# Altium project PCB_Project.PrjPcb
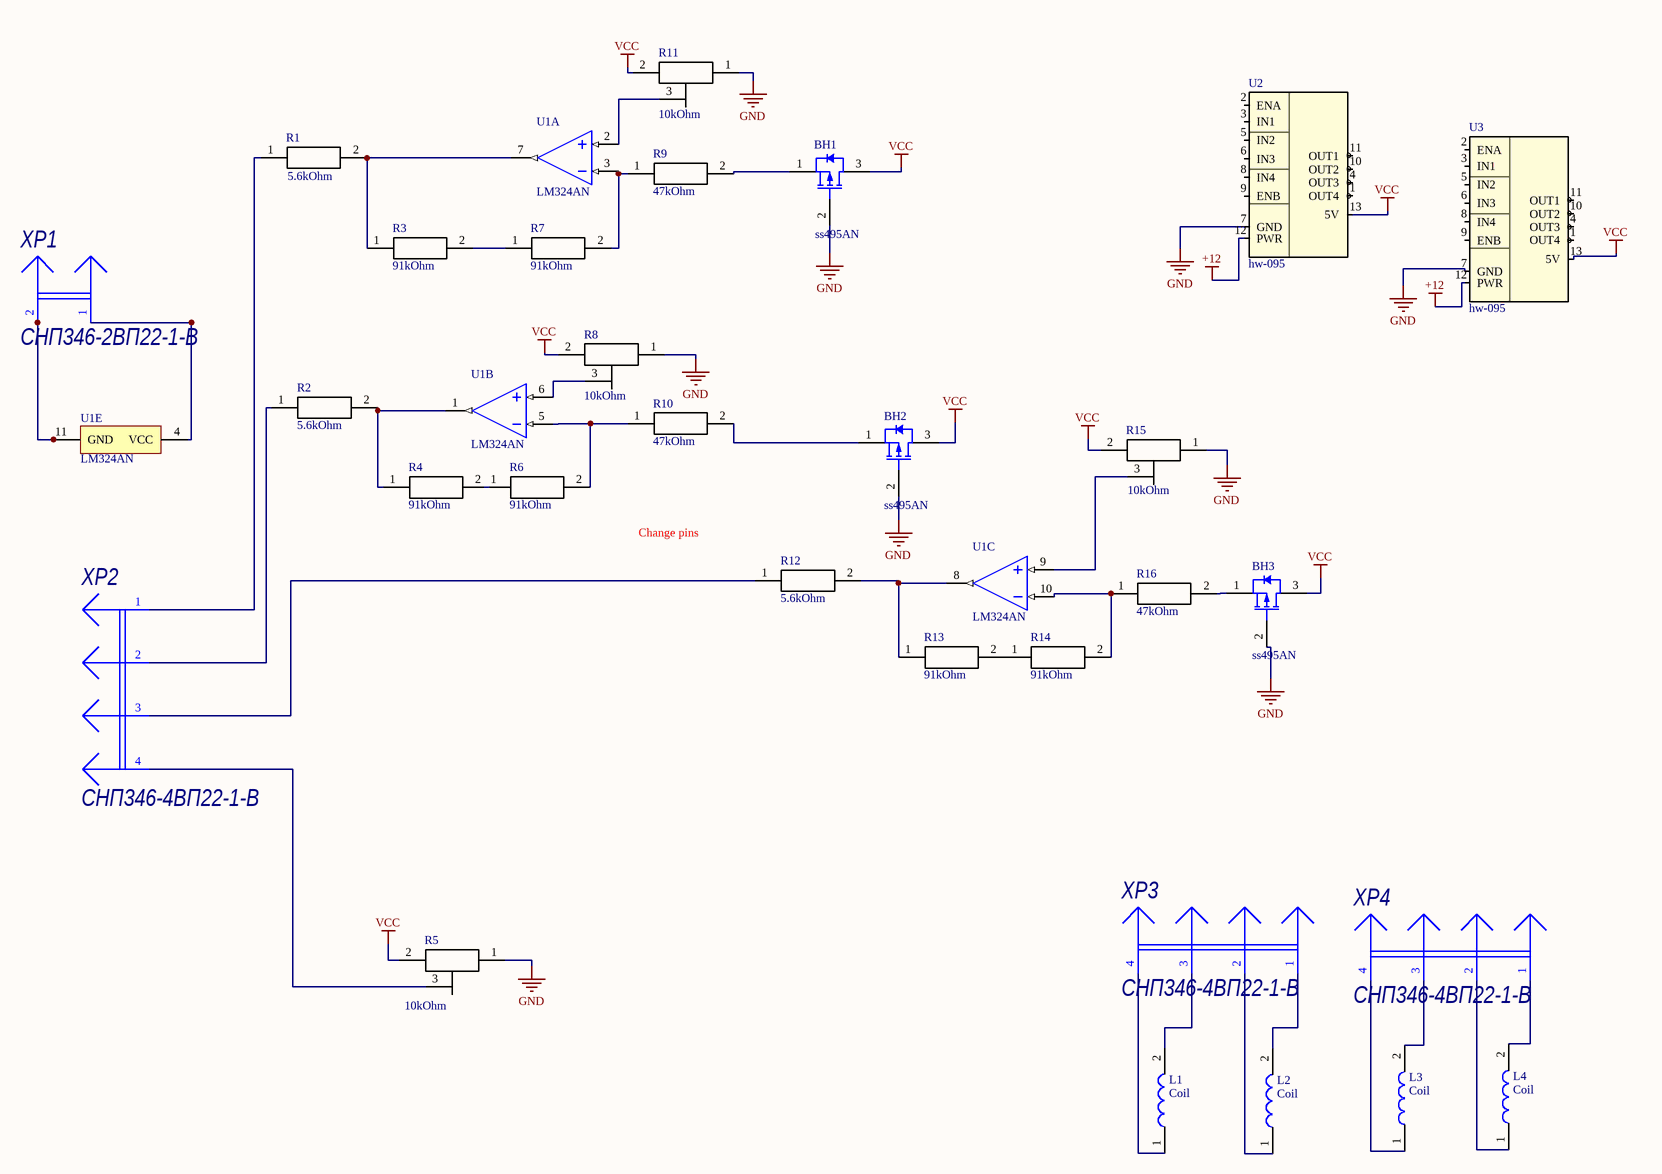
[diagram p0: Shсem gost.SchDoc]
1 sheet, 30 parts. Net scope: global (net labels, ports and power ports of the same name join across sheets).
Board file: PCB1.PcbDoc

## Sheet Shсem gost.SchDoc: Левитрон
size 420 x 297 mm; CheckedBy: Вейнмейстер А.В.; Author: Кузьмин И.Л.; CompanyName: СПбГЭТУ "ЛЭТИ"; DocumentNumber: АБВГ.ХХХХХХ.001 ЭЗ; SheetNumber: 1; SheetTotal: 1; DocumentType: Схема электрическая принципиальная; Scale: 1:1

### Parts
BH1  ss495AN  [DIOD-TO92-3]
BH2  ss495AN  [DIOD-TO92-3]
BH3  ss495AN  [DIOD-TO92-3]
L1  Coil  [INDUCTOR]
L2  Coil  [INDUCTOR]
L3  Coil  [INDUCTOR]
L4  Coil  [INDUCTOR]
R1  5.6kOhm  [RESISTOR2]
R2  5.6kOhm  [RESISTOR2]
R3  91kOhm  [RESISTOR2]
R4  91kOhm  [RESISTOR2]
R5  10kOhm  [R]
R6  91kOhm  [RESISTOR2]
R7  91kOhm  [RESISTOR2]
R8  10kOhm  [R]
R9  47kOhm  [RESISTOR2]
R10  47kOhm  [RESISTOR2]
R11  10kOhm  [R]
R12  5.6kOhm  [RESISTOR2]
R13  91kOhm  [RESISTOR2]
R14  91kOhm  [RESISTOR2]
R15  10kOhm  [R]
R16  47kOhm  [RESISTOR2]
U1  LM324AN  [TI-N0014A]  (parts A,B,C,E of 5)
U2  hw-095  [HW095]
U3  hw-095  [HW095]
XP1  СНП346-2ВП22-1-В  [PLS-2]
XP2  СНП346-4ВП22-1-В  [PLS-4]
XP3  СНП346-4ВП22-1-В  [PLS-4]
XP4  СНП346-4ВП22-1-В  [PLS-4]

### Nets
+12: U2.12(PWR) U3.12(PWR)
GND: BH1.2(G) BH2.2(G) BH3.2(G) R5.1 R8.1 R11.1 R15.1 U2.7(GND) U3.7(GND)
VCC: BH1.3(D) BH2.3(D) BH3.3(D) R5.2 R8.2 R11.2 R15.2 U2.13(5V) U3.13(5V)
NetBH1_1: BH1.1(S) R9.2
NetBH2_1: BH2.1(S) R10.2
NetBH3_1: BH3.1(S) R16.2
NetL1_1: L1.1 XP3.4
NetL1_2: L1.2 XP3.3
NetL2_1: L2.1 XP3.2
NetL2_2: L2.2 XP3.1
NetL3_1: L3.1 XP4.4
NetL3_2: L3.2 XP4.3
NetL4_1: L4.1 XP4.2
NetL4_2: L4.2 XP4.1
NetR1_1: R1.1 XP2.1
NetR1_2: R1.2 R3.1 U1.7(2OUT)
NetR2_1: R2.1 XP2.2
NetR2_2: R2.2 R4.1 U1.1(1OUT)
NetR3_2: R3.2 R7.1
NetR4_2: R4.2 R6.1
NetR5_3: R5.3 XP2.4
NetR6_2: R6.2 R10.1 U1.5(2IN+)
NetR7_2: R7.2 R9.1 U1.3(1IN+)
NetR8_3: R8.3 U1.6(2IN-)
NetR11_3: R11.3 U1.2(1IN-)
NetR12_1: R12.1 XP2.3
NetR12_2: R12.2 R13.1 U1.8(3OUT)
NetR13_2: R13.2 R14.1
NetR14_2: R14.2 R16.1 U1.10(3IN+)
NetR15_3: R15.3 U1.9(3IN-)
NetU1_4: U1.4(VCC) XP1.1
NetU1_11: U1.11(GND) XP1.2

Not connected (* = marked no-connect by the designer): U2 1(OUT4) 2(ENA) 3(IN1) 4(OUT3) 5(IN2) 6(IN3) 8(IN4) 9(ENB) 10(OUT2) 11(OUT1); U3 1(OUT4) 2(ENA) 3(IN1) 4(OUT3) 5(IN2) 6(IN3) 8(IN4) 9(ENB) 10(OUT2) 11(OUT1)

### Notes on the sheet
- Change pins
- Перв. примен.
- Справ. №
- Подп. и дата
- Инв. № дубл.
- Взам. инв. №
- Изм.
- Разраб.
- Лист
- № докум.
- Подп.
- Дата
- Лит.
- Масса
- Масштаб
- Т. контр
- Пров.
- Листов
- Инв. № подл.
- Н. контр
- Утв.
- Копировал
- Формат А3

### Library data of the parts
BH1-BH3 = CMP-013-00025-3: P-Channel Enhancement Mode Vertical DMOS FET, 60 VDS, 3-Pin TO92, RoHS, Bulk; Manufacturer: Diodes Inc; Typical Rise Time: 8ns; Power: 625mW; Rds On Max: 14Ohm; Nominal Vgs: -3.5V; Nominal Dual Supply Voltage: -60V; Elements: 1; Input Capacitance: 50pF; Datasheet Version: Rev. 2, 03/1994; Case/Package: TO-226-3; Package Reference: TO92-3; Min Operating Temperature: -55°C; Pins: 3; Packaging: Bulk; Package Quantity: 4000; RoHS Compliant: True; Package Description: 3-Pin Transistor Outline Package, Body Dia 4.57 mm, Pitch 1.27 mm; Datasheet URL: http://www.diodes.com/_files/datasheets/ZVP3306A.pdf; Max Operating Temperature: 150°C; Mounting Technology: TH
L1-L4 = Inductor
R1-R4 R6 R7 R9 R10 R12-R14 R16 = Resistor
R5 R8 R11 R15 = Res3
U1 = CMP-014-00016-1: Quadruple Operational Amplifier, 1.2 MHz, 0 to 70 degC, 14-Pin PDIP (N), Pb-Free (RoHS), Tube; Manufacturer: Texas Instruments (TI); Max Supply Voltage: 16V; Min Supply Voltage: 1.5V; Nominal Supply Current: 3mA; Nominal Voltage Gain: 100dB; Nominal Supply Voltage: 12V; Unity Gain Bandwidth Product: 1.2MHz; Output Current: 30mA; Max Dual Supply Voltage: 16V; Mounting Technology: TH; Datasheet URL: http://www.ti.com/lit/ds/symlink/lm324a.pdf; Min Dual Supply Voltage: 1.5V; Package Description: 14-Pin Double In-line Package, Body 19.305 x 6.35 mm, Pitch 2.54 mm; Package URL: http://www.ti.com/lit/ml/mpdi002c/mpdi002c.pdf; Pins: 14; Package Quantity: 25; Max Operating Temperature: 70°C; Case/Package: DIP; Min Operating Temperature: 0°C; Nominal Dual Supply Voltage: 12V; Manufacturer URL: http://www.ti.com/; RoHS Compliant: True; Package Reference: N-14; Datasheet Version: SLOS066W, 03/2015
XP1 = CMP-022-000001-1: Manufacturer: ОАО "Карачевский Завод "Электродеталь"; Working Temperature Min: -60°С; Surface Finish: Silver; Application Category: 5; Connector Type: Male; Specification: РЮМК.430420.011 ТУ; Resistance: 15mohm; Pitch: 2.54mm; Limit Voltage: 250V; Limit Current: 1A; Working Temperature Max: +85°С; Part Number: СНП346-2ВП22-1-В; Pins: 2; Functional Analog: PLS-2; Value: СНП346-2ВП22-1-В
XP2-XP4 = CMP-022-000003-1: Manufacturer: ОАО "Карачевский Завод "Электродеталь"; Application Category: 5; Pitch: 2.54mm; Working Temperature Min: -60°С; Specification: РЮМК.430420.011 ТУ; Connector Type: Male; Limit Voltage: 250V; Limit Current: 1A; Surface Finish: Silver; Working Temperature Max: +85°С; Resistance: 15mohm; Part Number: СНП346-4ВП22-1-В; Value: СНП346-4ВП22-1-В; Functional Analog: PLS-4; Pins: 4